# Altium schematic sheet EC3simple.SchDoc
size A4
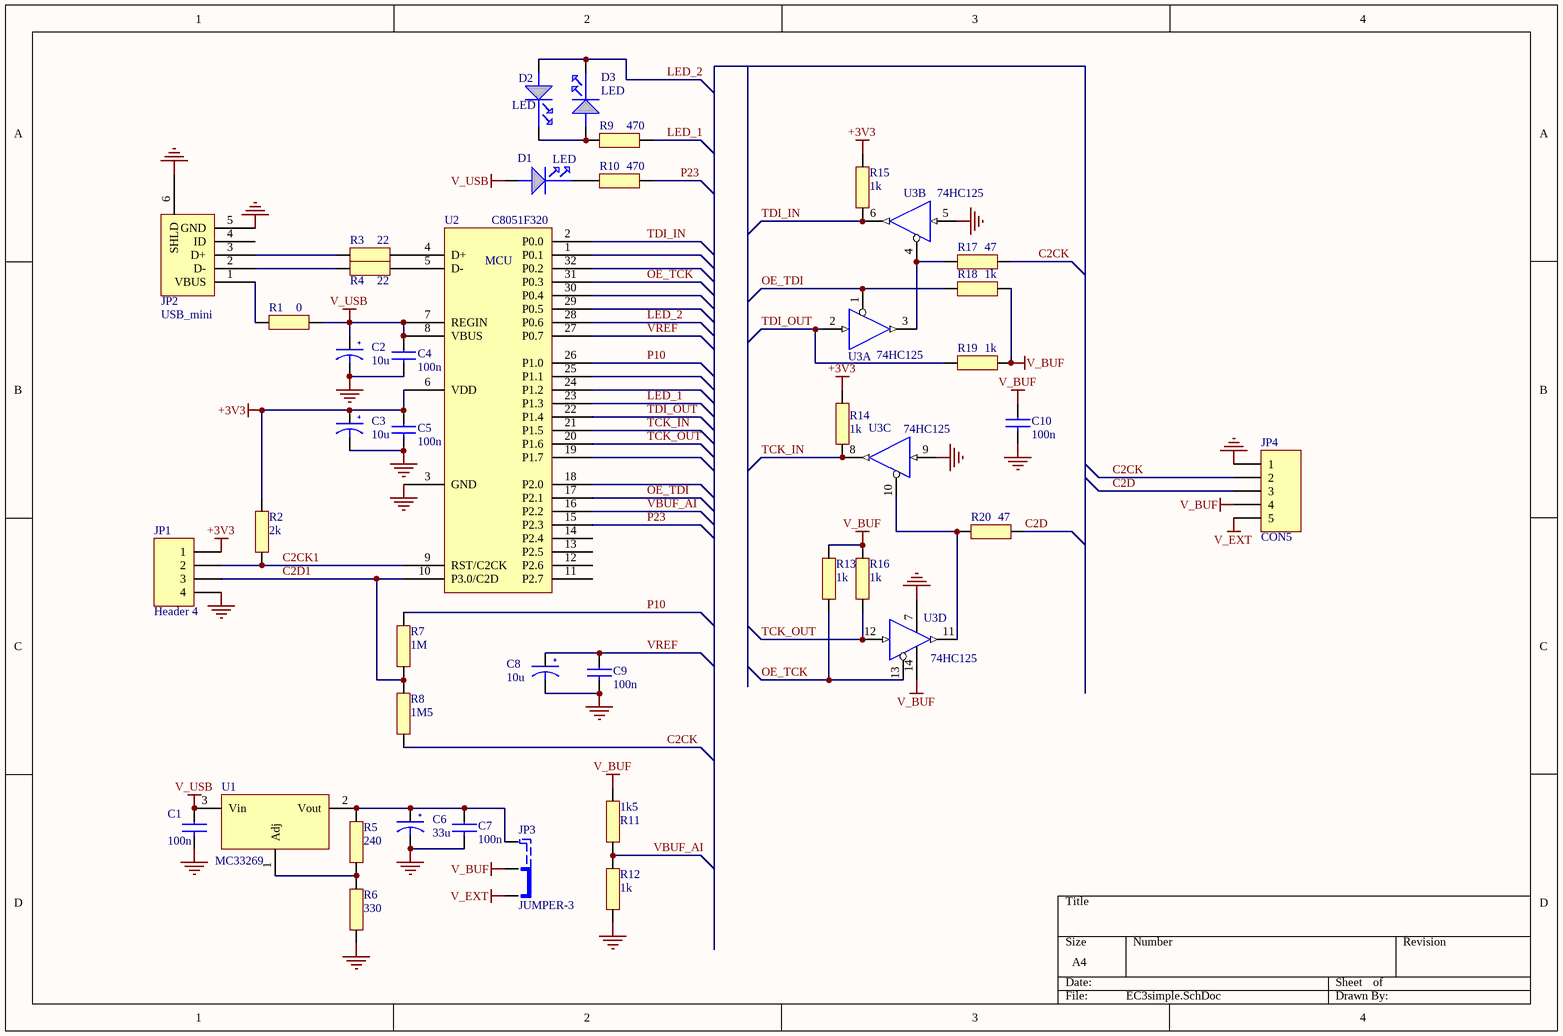
[diagram p0: EC3simple.SchDoc]

## Parts
C1  100n  [C-0805]
C2  10u  [TANTAL-A]
C3  10u  [TANTAL-A]
C4  100n  [C-0805]
C5  100n  [C-0805]
C6  33u  [TANTAL-B(3528)]
C7  100n  [C-0805]
C8  10u  [TANTAL-A]
C9  100n  [C-0805]
C10  100n  [C-0805]
D1  LED  [LED-DIP-1]
D2  LED  [LED-DIP-1]
D3  LED  [LED-DIP-1]
JP1  Header 4  [HDR1X4]
JP2  USB_mini  [miniUSBsmd]
JP3  JUMPER-3  [IDC1-3P]
JP4  CON5  [IDC1-5P]
R1  0  [R-1206]
R2  2k  [R-0805]
R3  22  [R-0805]
R4  22  [R-0805]
R5  240  [R-0805]
R6  330  [R-0805]
R7  1M  [R-0805]
R8  1M5  [R-0805]
R9  470  [R-0805]
R10  470  [R-0805]
R11  1k5  [R-0805]
R12  1k  [R-0805]
R13  1k  [R-0805]
R14  1k  [R-0805]
R15  1k  [R-0805]
R16  1k  [R-0805]
R17  47  [R-0805]
R18  1k  [R-0805]
R19  1k  [R-0805]
R20  47  [R-0805]
U1  MC33269  [SOT-428-(D-PAK)]
U2  C8051F320  [QFP32]
U3  74HC125  [SO14-(SOT-108-1)]  (parts A,B,C,D of 4)

## Nets
+3V3: C3.2(+) C5.1 JP1.1 R2.1 R14.1 R15.1 U2.6(VDD)
GND: C1.2 C2.1(-) C3.1(-) C4.2 C5.2 C6.1(-) C7.2 C8.1(-) C9.2 C10.2 JP1.4 JP2.5(GND) JP2.6(SHLD) JP4.1 R6.2 R12.2 U2.3(GND) U3.5(B) U3.7(GND-D) U3.9(C)
V_BUF: C10.1 JP3.2 JP4.4 R11.1 R13.1 R16.1 R18.2 R19.2 U3.14(VCC)
V_EXT: JP3.1 JP4.5
V_USB: C1.1 C2.2(+) C4.1 D1.A(ANODE) R1.2 U1.3(Vin) U2.7(REGIN) U2.8(VBUS)
C2CK: JP4.2 R8.2 R17.2
C2CK1: JP1.2 R2.2 U2.9(RST/C2CK)
C2D: JP4.3 R20.2
C2D1: JP1.3 R7.2 R8.1 U2.10(P3.0/C2D)
LED_1: R9.2 U2.23(P1.3)
LED_2: D2.A(ANODE) D3.K(CATHODE) U2.28(P0.6)
OE_TCK: R13.2 U2.31(P0.3) U3.13(~{-Ed})
OE_TDI: R18.1 U2.17(P2.1) U3.1(~{-Ea})
P10: R7.1 U2.26(P1.0)
P23: R10.2 U2.15(P2.3)
TCK_IN: R14.2 U2.21(P1.5) U3.8(Yc)
TCK_OUT: R16.2 U2.20(P1.6) U3.12(D)
TDI_IN: R15.2 U2.2(P0.0) U3.6(Yb)
TDI_OUT: R19.1 U2.22(P1.4) U3.2(A)
VBUF_AI: R11.2 R12.1 U2.16(P2.2)
VREF: C8.2(+) C9.1 U2.27(P0.7)
NetC6_2: C6.2(+) C7.1 JP3.3 R5.1 U1.2(Vout)
NetD1_K: D1.K(CATHODE) R10.1
NetD2_K: D2.K(CATHODE) D3.A(ANODE) R9.1
NetJP2_1: JP2.1(VBUS) R1.1
NetJP2_2: JP2.2(D-) R4.1
NetJP2_3: JP2.3(D+) R3.1
NetR3_2: R3.2 U2.4(D+)
NetR4_2: R4.2 U2.5(D-)
NetR5_2: R5.2 R6.1 U1.1(Adj)
NetR17_1: R17.1 U3.3(Ya) U3.4(~{-Eb})
NetR20_1: R20.1 U3.10(~{-Ec}) U3.11(Yd)

Not connected (* = marked no-connect by the designer): JP2 4(ID); U2 1(P0.1) 11(P2.7) 12(P2.6) 13(P2.5) 14(P2.4) 18(P2.0) 19(P1.7) 24(P1.2) 25(P1.1) 29(P0.5) 30(P0.4) 32(P0.2)

## Notes on the sheet
- (in symbol C8051F320) MCU

## Library data of the parts
C1 C4 C5 C7 C9 C10 = C: Производитель: *; Точность: *; Напряжение: *; Тип диэлектрика: *
C2 C3 C6 C8 = C-EL-TAN: Производитель: *; Точность: *; Напряжение: *; Тип диэлектрика: *
JP1 = Header 4: Header, 4-Pin; LatestRevisionDate: 17-Jul-2002; LatestRevisionNote: Re-released for DXP Platform.; Publisher: Altium Limited
JP3 = JUMPER-3: Jumper; Производитель: *; Допустимая замена: *; Цена: *; PDF файл: *; Температурный диапазон: *; Описание пользователя: *; Конфигурация контактов RxNN: *; *: *
R1-R20 = R: Производитель: *; Точность: *; Тип: *
U1 = MC33269: low dropout adjustable positive voltage regulators; Производитель: *; Допустимая замена: *; Цена: *; PDF файл: *; Температурный диапазон: *
U3 = 74HC125: Four Buffers with Enable for HiZ state output; Производитель: *; Допустимая замена: *; Цена: *; PDF файл: *; Температурный диапазон: *
JP4 = CON5: Производитель: *; Допустимая замена: *; Цена: *; PDF файл: *; Температурный диапазон: *; Описание пользователя: *; Конфигурация контактов RxNN: *; *: *